# EAGLE schematic F1-T12_compact (EAGLE 9.2.0)
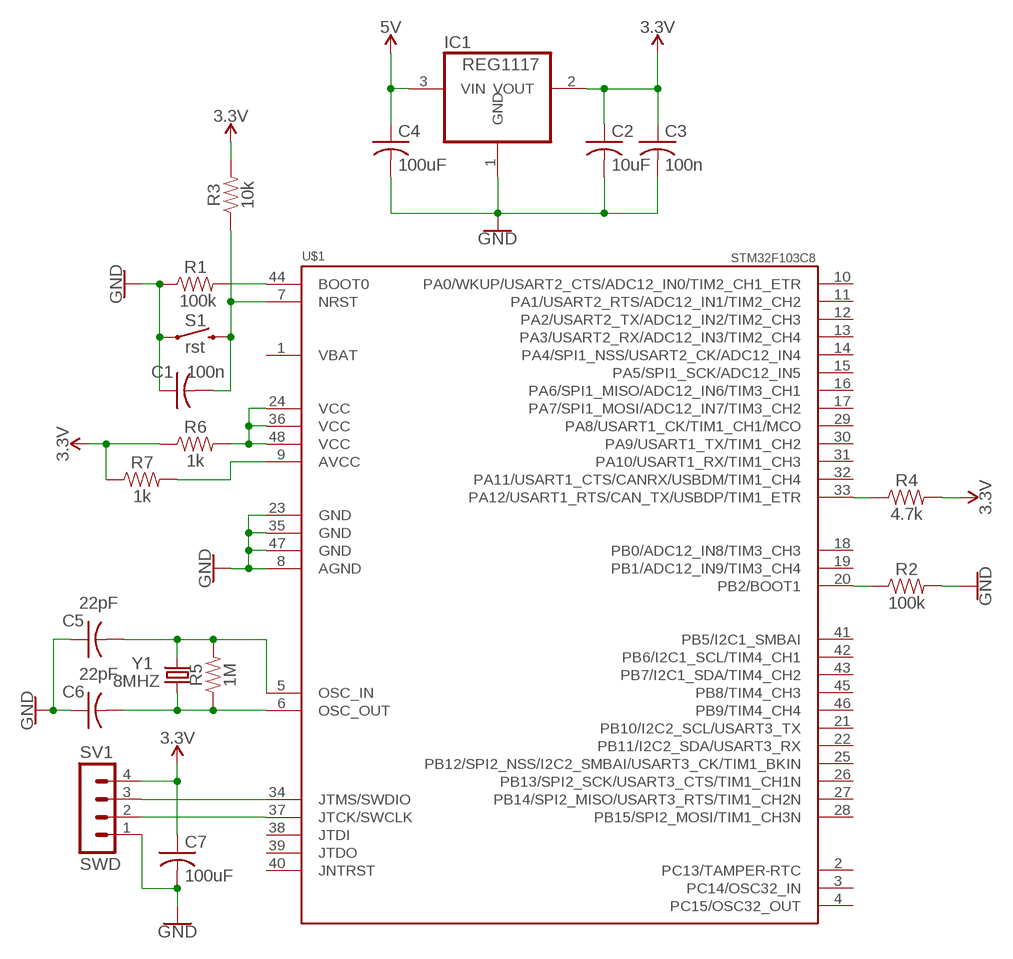
[diagram p0: schematic, sheet 1]

## Parts
C1  100n  C_USD  [1206]
C2  10uF  C_USD  [1206]
C3  100n  C_USD  [1206]
C4  100uF  C_USF  [1812]
C5  22pF  C_USD  [1206]
C6  22pF  C_USD  [1206]
C7  100uF  C_USF  [1812]
IC1  REG1117  [SOT223]
R1  100k  RESISTOR1206  [1206]
R2  100k  RESISTOR1206  [1206]
R3  10k  RESISTOR1206  [1206]
R4  4.7k  RESISTOR1206  [1206]
R5  1M  RESISTOR1206  [1206]
R6  1k  RESISTOR1206  [1206]
R7  1k  RESISTOR1206  [1206]
S1  rst  MOMENTARY-SWITCH-SPST-SMD-4.6X2.8MM  [TACTILE_SWITCH_SMD_4.6X2.8MM]
SV1  SWD  MA04-1  [MA04-1]
U$1  STM32F103C8  [LQFP48-7X7]
Y1  8MHZ  CRYSTALHC49US  [HC49US]

## Nets
3.3V: C2.1 C3.1 C7.1 IC1.2(VOUT) R3.2 R4.2 R6.1 R7.1 SV1.4
5V: C4.1 IC1.3(VIN)
GND: C1.1 C2.2 C3.2 C4.2 C5.1 C6.1 C7.2 IC1.1(GND) R1.1 R2.2 S1.1 S1.2 SV1.1 U$1.8(AGND) U$1.23(GND) U$1.35(GND) U$1.47(GND)
N$1: R1.2 U$1.44(BOOT0)
N$2: R2.1 U$1.20(PB2/BOOT1)
N$3: C1.2 R3.1 S1.3 S1.4 U$1.7(NRST)
N$4: SV1.3 U$1.34(JTMS/SWDIO)
N$5: R4.1 U$1.33(PA12/USART1_RTS/CAN_TX/USBDP/TIM1_ETR)
N$6: C5.2 R5.2 U$1.5(OSC_IN) Y1.2
N$7: C6.2 R5.1 U$1.6(OSC_OUT) Y1.1
N$8: SV1.2 U$1.37(JTCK/SWCLK)
N$9: R7.2 U$1.9(AVCC)
N$10: R6.2 U$1.24(VCC) U$1.36(VCC) U$1.48(VCC)
Unconnected: U$1.2(PC13/TAMPER-RTC) U$1.3(PC14/OSC32_IN) U$1.4(PC15/OSC32_OUT) U$1.10(PA0/WKUP/USART2_CTS/ADC12_IN0/TIM2_CH1_ETR) U$1.11(PA1/USART2_RTS/ADC12_IN1/TIM2_CH2) U$1.12(PA2/USART2_TX/ADC12_IN2/TIM2_CH3) U$1.13(PA3/USART2_RX/ADC12_IN3/TIM2_CH4) U$1.14(PA4/SPI1_NSS/USART2_CK/ADC12_IN4) U$1.15(PA5/SPI1_SCK/ADC12_IN5) U$1.16(PA6/SPI1_MISO/ADC12_IN6/TIM3_CH1) U$1.17(PA7/SPI1_MOSI/ADC12_IN7/TIM3_CH2) U$1.18(PB0/ADC12_IN8/TIM3_CH3) U$1.19(PB1/ADC12_IN9/TIM3_CH4) U$1.21(PB10/I2C2_SCL/USART3_TX) U$1.22(PB11/I2C2_SDA/USART3_RX) U$1.25(PB12/SPI2_NSS/I2C2_SMBAI/USART3_CK/TIM1_BKIN) U$1.26(PB13/SPI2_SCK/USART3_CTS/TIM1_CH1N) U$1.27(PB14/SPI2_MISO/USART3_RTS/TIM1_CH2N) U$1.28(PB15/SPI2_MOSI/TIM1_CH3N) U$1.29(PA8/USART1_CK/TIM1_CH1/MCO) U$1.30(PA9/USART1_TX/TIM1_CH2) U$1.31(PA10/USART1_RX/TIM1_CH3) U$1.32(PA11/USART1_CTS/CANRX/USBDM/TIM1_CH4) U$1.38(JTDI) U$1.39(JTDO) U$1.40(JNTRST) U$1.41(PB5/I2C1_SMBAI) U$1.42(PB6/I2C1_SCL/TIM4_CH1) U$1.43(PB7/I2C1_SDA/TIM4_CH2) U$1.45(PB8/TIM4_CH3) U$1.46(PB9/TIM4_CH4)

## Power pins joined to a net without a drawn wire
VBAT: U$1.1(VBAT)

## Library data of the parts
C1-C7 = MAX9812:C_US: Capacitors in various packages
IC1 = burr-brown:REG1117: 800mA and 1A Low Dropout (LDO) Positive Regulator 1.8V, 2.5V, 2.85V, 3.3V, 5V, and Adj; MPN: REG1117; OC_FARNELL: 1097566; OC_NEWARK: 14P6981
R1-R7 = SparkFun-Resistors:RESISTOR: Generic Resistor Package
S1 = SparkFun-Switches:MOMENTARY-SWITCH-SPST: Momentary Switch (Pushbutton) - SPST Normally-open (NO) SPST momentary switches (buttons, pushbuttons). Variants PTH-12MM - 12mm square, through-hole Momentary Pushbutton Switch - 12mm Square <https://www.sparkfun.com/products/9190> (COM-09190) PTH-6.0MM, PTH-6.0MM-KIT - 6.0mm square, through-hole Mini Pushbutton Switch <https://www.sparkfun.com/products/97> (COM-00097) KIT package intended for soldering kit's - only one side of pads' copper is exposed. PTH-RIGHT-ANGLE-KIT - Right-angle, through-hole Right Angle Tactile Button <https://www.sparkfun.com/products/10791> - Used on SparkFun BigTime Watch Kit <https://www.sparkfun.com/products/11734> SMD-12MM - 12mm square, surface-mount Tactile Button - SMD (12mm) <https://www.sparkfun.com/products/12993> (COM-12993) Used on SparkFun PicoBoard <https://www.sparkfun.com/products/11888> SMD-4.5MM - 4.5mm Square Trackball Switch Used on SparkFun Blackberry Trackballer Breakout <https://www.sparkfun.com/products/13169> SMD-4.6MMX2.8MM - 4.60mm x 2.80mm, surface mount Used on SparkFun SAMD21 Mini Breakout <https://www.sparkfun.com/products/13664> SMD-5.2MM, SMD-5.2-REDUNDANT - 5.2mm square, surface-mount Mini Pushbutton Switch - SMD <https://www.sparkfun.com/products/8720> (COM-08720) Used on Arduino Pro Mini <https://www.sparkfun.com/products/11114> REDUNDANT package connects both switch circuits together SMD-6.0X3.5MM - 6.0 x 3.5mm, surface mount Momentary Reset Switch SMD <https://www.sparkfun.com/products/8229> (COM-08229) SMD-6.2MM-TALL - 6.2mm square, surface mount Tactile Button - SMD (6mm) <https://www.sparkfun.com/products/12992> Used on SparkFun Digital Sandbox <https://www.sparkfun.com/products/12651> SMD-RIGHT-ANGLE - Right-angle, surface mount Used on SparkFun Block for Intel® Edison - Arduino <https://www.sparkfun.com/products/13036>; PROD_ID: SWCH-13065
SV1 = con-lstb:MA04-1: PIN HEADER; OC_FARNELL: unknown; OC_NEWARK: unknown
U$1 = stm32:STM32F103C8
Y1 = SparkFun:CRYSTAL: Crystals Various standard crystals. Proven footprints. Spark Fun Electronics SKU : COM-00534